# EAGLE design main (EAGLE 6.4)
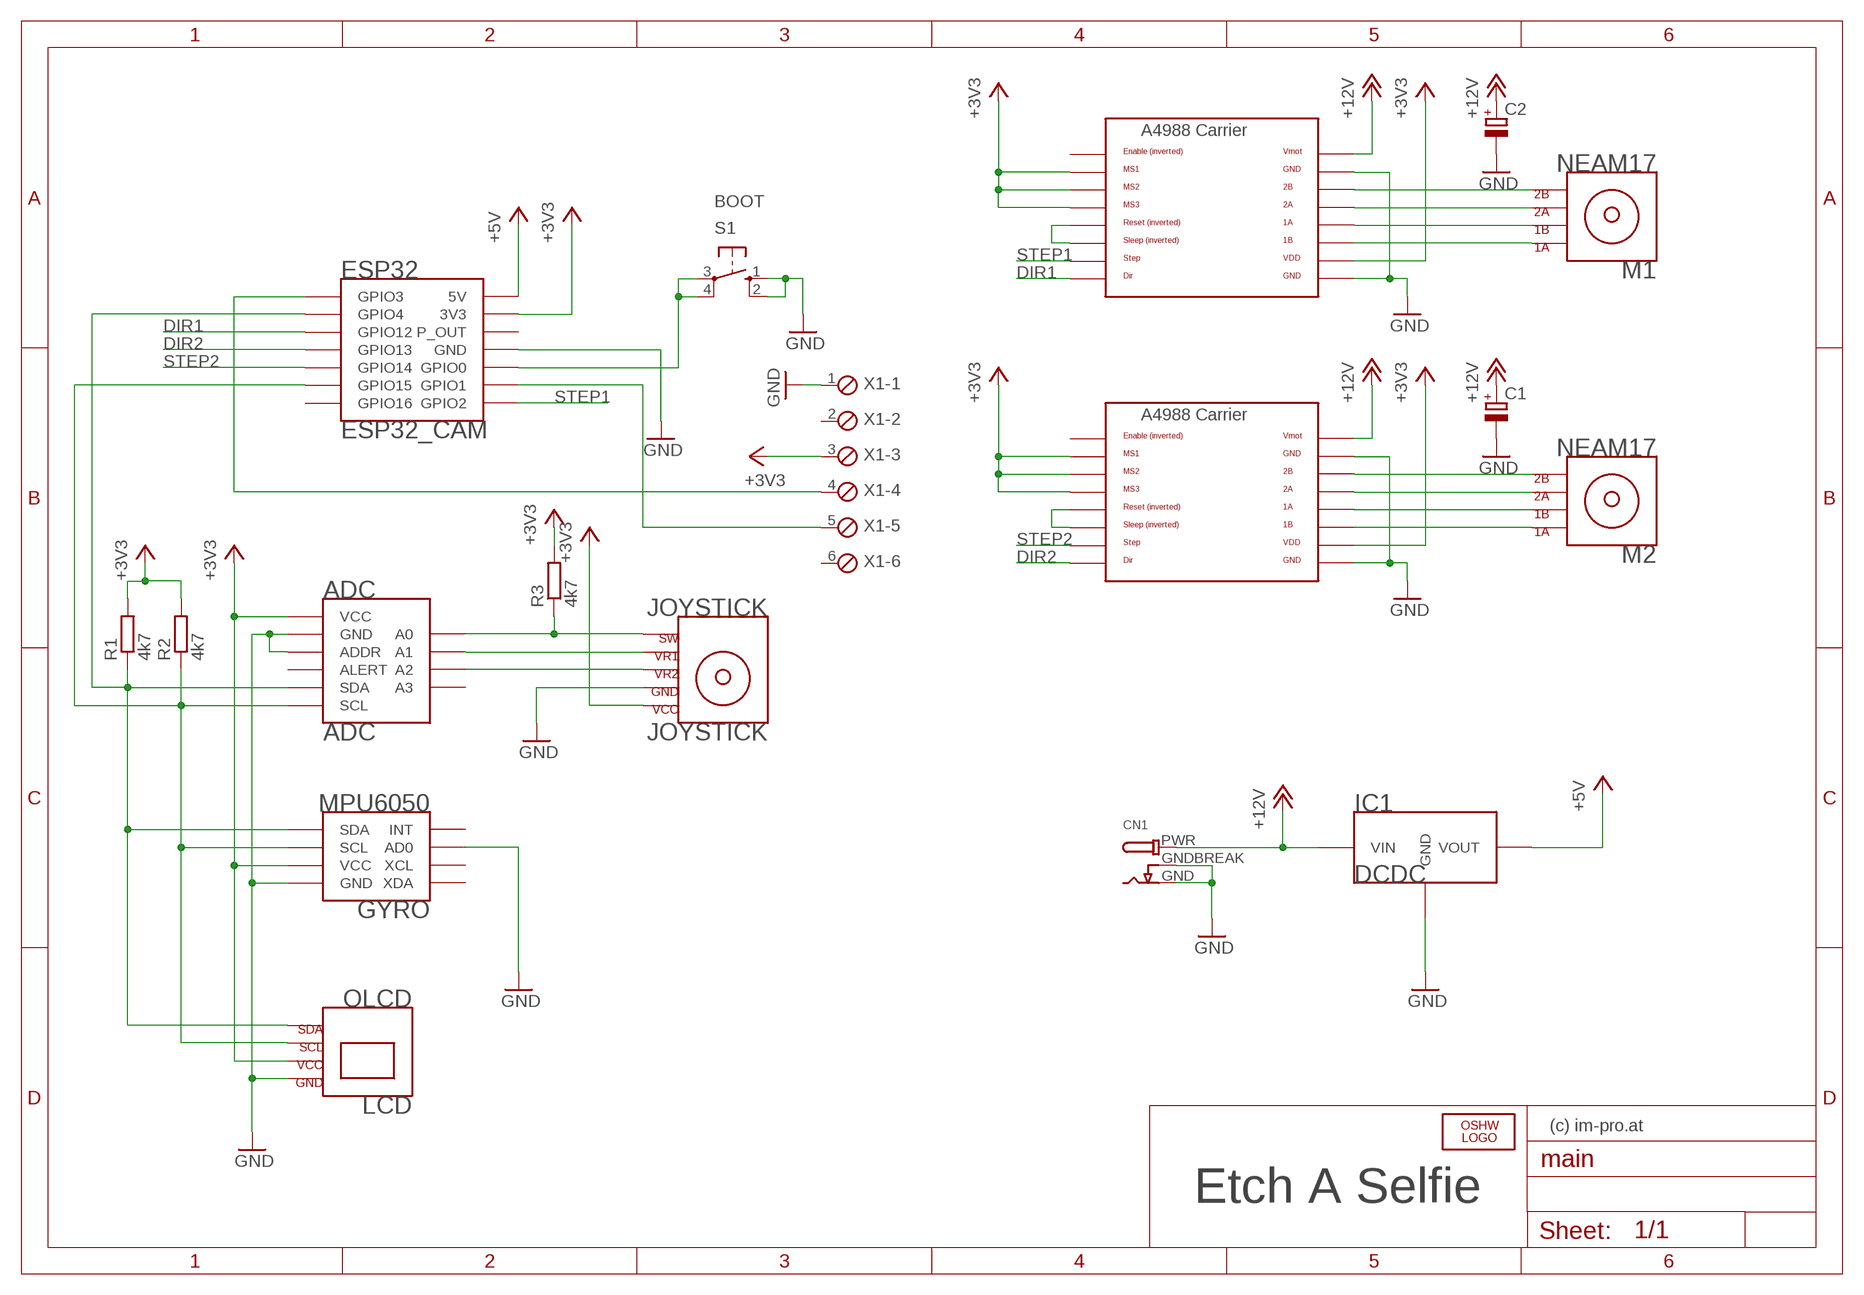
[diagram p0: schematic, sheet 1]

## Parts
ADC  ADC  [ADC]
C1  CPOL-EUE2.5-6  [E2,5-6]
C2  CPOL-EUE2.5-6  [E2,5-6]
CN1  DCBARRELPTH  [DCJACK_2MM_PTH]
ESP32  ESP32_CAM  [ESP32_CAM]
GYRO  MPU6050  [MPU6050]
IC1  DCDC  [DCDC]
IC2  A4988BREAKOUT  [A4988BREAKOUT]
IC3  A4988BREAKOUT  [A4988BREAKOUT]
JOYSTICK  JOYSTICK  [JOYSTICK]
LCD  OLCD  [OLCD]
LOGO1  OHW-LOGO_OSHW_LOGO_FILLX0350-NT  [OHW-LOGO_OSHW_FILLX350_NOTEXT]
M1  NEAM17  [NEMA17]
M2  NEAM17  [NEMA17]
R1  4k7  R-EU_0207/10  [0207/10]
R2  4k7  R-EU_0207/10  [0207/10]
R3  4k7  R-EU_0207/10  [0207/10]
S1  10-XX  [B3F-10XX]
X1  MPT6  [6POL254]

## Nets
+3V3: ADC.VCC ESP32.3V3 GYRO.VCC IC2.MS1 IC2.MS2 IC2.MS3 IC2.VDD IC3.MS1 IC3.MS2 IC3.MS3 IC3.VDD JOYSTICK.VCC LCD.VCC R1.2 R2.2 R3.2 X1.3
+5V: ESP32.5V IC1.VOUT
+12V: C1.+ C2.+ CN1.PWR IC1.VIN IC2.VMOT IC3.VMOT
DIR1: ESP32.GPIO12 IC2.DIR
DIR2: ESP32.GPIO13 IC3.DIR
GND: ADC.ADDR ADC.GND C1.- C2.- CN1.GND CN1.GNDBREAK ESP32.GND1(GND) ESP32.GND2(GND) ESP32.GND3(GND) GYRO.AD0 GYRO.GND IC1.GND1(GND) IC1.GND2(GND) IC2.GND IC2.GND@0(GND) IC3.GND IC3.GND@0(GND) JOYSTICK.GND LCD.GND S1.1(S) S1.2(S1) X1.1
N$1: IC2.1B M1.1A
N$2: IC2.RST IC2.SLP(SLEEP)
N$3: IC2.2B M1.2B
N$4: IC2.2A M1.2A
N$5: IC2.1A M1.1B
N$6: IC3.RST IC3.SLP(SLEEP)
N$7: IC3.2B M2.2B
N$8: IC3.2A M2.2A
N$9: IC3.1A M2.1B
N$10: IC3.1B M2.1A
N$11: ESP32.GPIO1 X1.5
N$12: ESP32.GPIO3 X1.4
N$13: ESP32.GPIO0 S1.3(P) S1.4(P1)
N$14: ADC.A0 JOYSTICK.SW R3.1
N$15: ADC.A1 JOYSTICK.VR1
N$16: ADC.A2 JOYSTICK.VR2
N$18: ADC.SCL ESP32.GPIO15 GYRO.SCL LCD.SCL R2.1
N$19: ADC.SDA ESP32.GPIO4 GYRO.SDA LCD.SDA R1.1
STEP1: ESP32.GPIO2 IC2.STEP
STEP2: ESP32.GPIO14 IC3.STEP
Unconnected: ADC.A3 ADC.ALERT ESP32.GPIO16 ESP32.P_OUT GYRO.INT GYRO.XCL GYRO.XDA IC2.EN IC3.EN X1.2 X1.6

## Notes on the sheet
- BOOT
- (c) im-pro.at
- Etch A Selfie

## Library data of the parts
ADC = main:ADC
C1 C2 = rcl:CPOL-EU: POLARIZED CAPACITOR, European symbol
CN1 = microbuilder:DCBARREL: DC Barrel Jack DCJACK_1.3MM_PTH - Through Hole 1.3mm Jack (4UConnector: 05536) DCJACK_2MM_PTH - Through Hole 2.0/2.1 Jack (4UConnector: 05537) DCJACK_2MM_SMT - SMT 2.0/2.1mm Jack(4UConnector: 03267)
ESP32 = main:ESP32_CAM
GYRO = main:MPU6050
IC1 = main:DCDC
IC2 IC3 = stepperdriver:A4988BREAKOUT
JOYSTICK = main:JOYSTICK
LCD = main:OLCD
LOGO1 = BBLeo_v2:OHW-LOGO_OSHW_LOGO_FILL
M1 M2 = main:NEAM17
R1-R3 = rcl:R-EU_: RESISTOR, European symbol
S1 = switch-omron:10-XX: OMRON SWITCH; MPN: B3F-1000; OC_FARNELL: 176432; OC_NEWARK: 36M3542
X1 = con-phoenix-254:MPT6: PHOENIX CONNECTOR; OC_FARNELL: unknown; OC_NEWARK: unknown

## Board
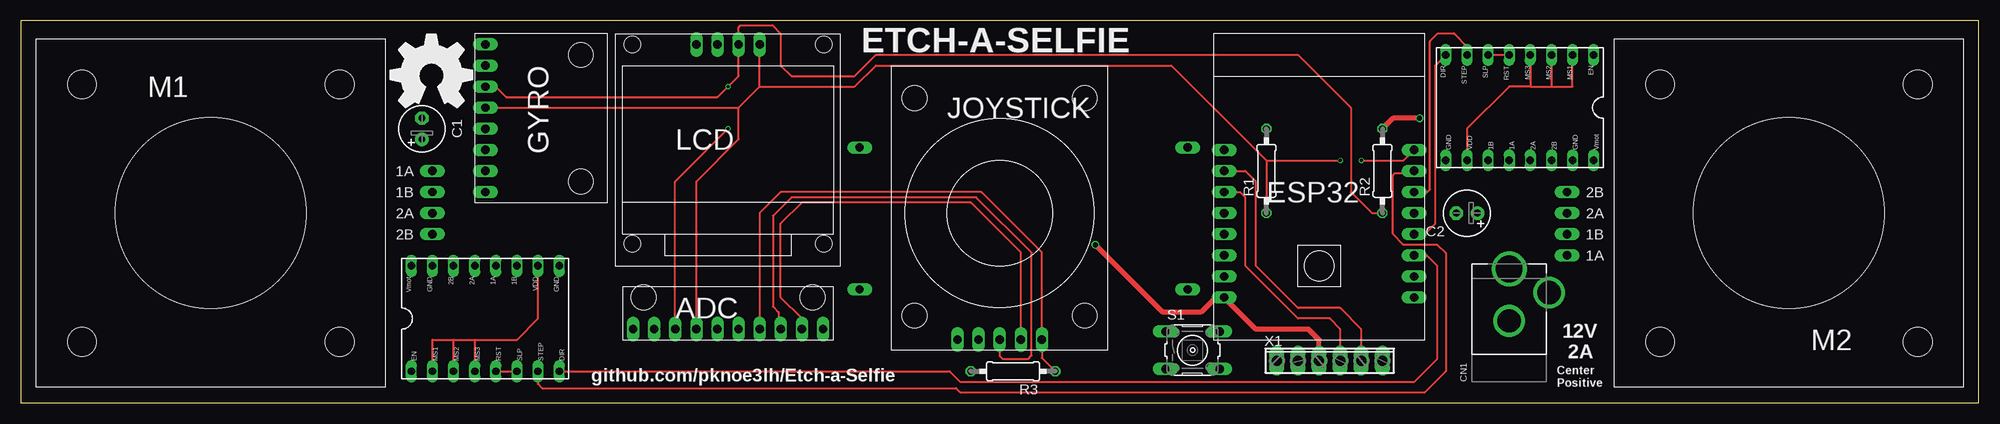
[diagram p1: board, top side]
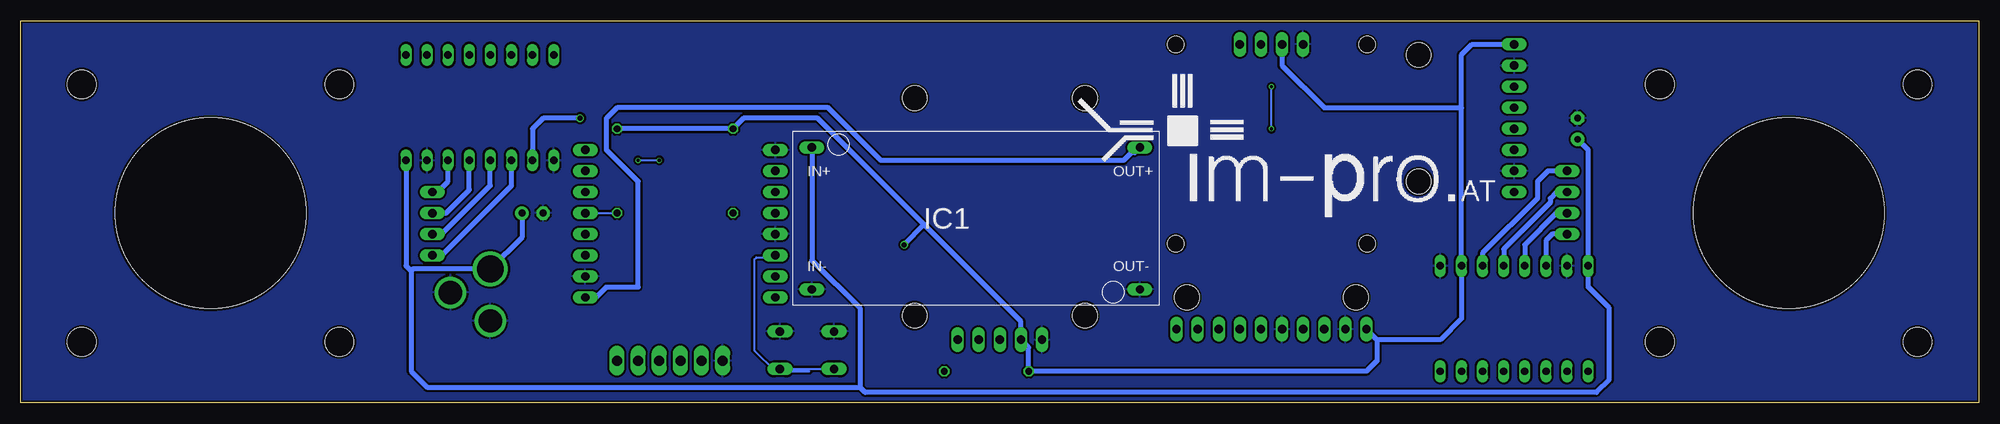
[diagram p2: board, bottom side, seen from below]

Size 235.56 x 46.03 mm. Coordinates in mm from the lower left corner, seen from the top.
Outline: 0,0 235.56,0 235.56,46.03 0,46.03 0,0
Copper layers (1*16): Top 0.035559375mm / dielectric 1.6mm / Bottom 0.035559375mm
Design rules "jlcpcb2layer": minimum track width 5mil, minimum drill 12mil, track to track 5mil, track to pad 5mil, pad to pad 5mil, via to via 5mil, smd to smd 5mil, copper to edge 8mil, drill to drill 6mil, minimum pad ring 5mil, minimum via ring 3mil, stop-mask expansion 2.5mil, vias tented up to drill 0mil, thermal gap 10mil

### Footprints (pad centres in the part's own frame; a part is rotated, then mirrored left to right if it is on the bottom)
ADC = drill 1 long: A0 3.81,0; A1 6.35,0; A2 8.89,0; A3 11.43,0; ADDR -1.27,0; ALERT 1.27,0; GND -8.89,0; SCL -6.35,0; SDA -3.81,0; VCC -11.43,0 | hole 3: -10.16,3.81; 10.16,3.81
E2,5-6 = drill 0.813 pad 1.6: + -1.27,0 | drill 0.813 pad 1.6 octagon: - 1.27,0
DCJACK_2MM_PTH = drill 2.8: GND 0,7.35; GNDBREAK 4.8,10.75 | drill 3.2: PWR 0,13.6
ESP32_CAM = drill 1 long: 3V3 -11.43,-12.7; 5V 11.43,-12.7; GND1 -11.43,5.08; GND2 -11.43,-5.08; GND3 11.43,-10.16; GPIO0 -11.43,-7.62; GPIO1 -11.43,2.54; GPIO2 11.43,2.54; GPIO3 -11.43,0; GPIO4 11.43,5.08; GPIO12 11.43,-7.62; GPIO13 11.43,-5.08; GPIO14 11.43,0; GPIO15 11.43,-2.54; GPIO16 -11.43,-10.16; P_OUT -11.43,-2.54
MPU6050 = drill 1 long: AD0 6.35,0; GND -6.35,0; INT 8.89,0; SCL -3.81,0; SDA -1.27,0; VCC -8.89,0; XCL 3.81,0; XDA 1.27,0 | hole 3: -7.62,11.5; 7.62,11.5
DCDC = drill 1 long: GND1 -19.73,-8.55; GND2 19.73,-8.55; VIN -19.73,8.55; VOUT 19.73,8.55
A4988BREAKOUT = drill 0.9 long: 1A 8.89,1.27; 1B 11.43,1.27; 2A 6.35,1.27; 2B 3.81,1.27; DIR 16.51,-11.43; EN -1.27,-11.43; GND 16.51,1.27; GND@0 1.27,1.27; MS1 1.27,-11.43; MS2 3.81,-11.43; MS3 6.35,-11.43; RST 8.89,-11.43; SLP 11.43,-11.43; STEP 13.97,-11.43; VDD 13.97,1.27; VMOT -1.27,1.27
JOYSTICK = drill 1 long: GND -5.08,0; SW 5.08,0; VCC -2.54,0; VR1 0,0; VR2 2.54,0 | hole 3: -10.25,2.9; 10.25,2.9; -10.25,29.1; 10.25,29.1
OLCD = drill 1 long: GND -3.81,0; SCL 1.27,0; SDA 3.81,0; VCC -1.27,0 | hole 2: -11.5,0; 11.5,0; -11.5,-24; 11.5,-24
NEMA17 = drill 1 long: 1A 26.67,5.08; 1B 26.67,2.54; 2A 26.67,0; 2B 26.67,-2.54 | hole 3.5: -15.5,-15.5; -15.5,15.5; 15.5,15.5; 15.5,-15.5 | hole 23: 0,0
0207/10 = drill 0.813 octagon: 1 -5.08,0; 2 5.08,0
B3F-10XX = drill 1.016 long: 1 -3.251,2.261; 2 3.251,2.261; 3 -3.251,-2.261; 4 3.251,-2.261
6POL254 = drill 1.2 pad 1.778 long: 1 -6.35,0; 2 -3.81,0; 3 -1.27,0; 4 1.27,0; 5 3.81,0; 6 6.35,0

### Placement (x,y rotation side)
ADC  85.09,8.89 0 top
C1  48.26,33.02 90 top
C2  173.99,22.86 180 top
CN1  179.07,2.54 0 top
ESP32  156.21,25.4 0 top
GYRO  55.88,34.29 270 top
IC1  120.65,22.22 0 bottom
IC2  48.26,15.24 0 top
IC3  187.96,30.48 180 top
JOYSTICK  117.77,7.62 0 top
LCD  85.09,43.18 0 top
LOGO1  44.45,35.56 0 top
M1  22.86,22.86 0 top
M2  212.73,22.86 180 top
R1  149.86,27.94 90 top
R2  163.83,27.94 90 top
R3  119.38,3.81 180 top
S1  140.97,6.35 0 top
X1  157.48,5.08 0 top

### Tracks (layer width: path | path; a pad name or v marks a point on that pad's centre or on a via)
+3V3  (via drill 0.6)
  Top 0.254: IC3.MS3 181.61,38.1 | 181.61,38.1 184.15,38.1 | 184.15,38.1 186.69,38.1 IC3.MS1 | IC3.MS2 184.15,38.1 | 181.61,38.1 179.07,38.1 173.99,33.02 IC3.VDD | IC2.MS1 49.53,7.62 52.07,7.62 | 52.07,7.62 54.61,7.62 | 54.61,7.62 IC2.MS3 | IC2.MS2 52.07,7.62 | 54.61,7.62 59.69,7.62 62.23,10.16 IC2.VDD
  Top 0.61: X1.3 156.21,7.62 154.94,8.89 148.59,8.89 ESP32.3V3 143.76,12.7 141.99,10.92 137.41,10.92 v129.29,19.05 | v168.28,34.29 165.1,34.29 R2.2
  Bottom 0.61: 173.99,30.48 IC3.VDD 173.99,33.02 172.72,34.29 v168.28,34.29 | 62.23,35.56 IC2.VDD 62.23,10.16 64.77,7.62 72.39,7.62 | 62.23,35.56 62.23,41.91 60.96,43.18 GYRO.VCC | 62.23,35.56 78.74,35.56 83.82,40.64 LCD.VCC | ADC.VCC 72.39,7.62 | 72.39,7.62 72.39,5.08 73.66,3.81 R3.2 114.3,6.69 JOYSTICK.VCC 115.23,9.82 126.87,21.46 | 126.87,21.46 139.7,34.29 148.59,34.29 R1.2 R2.2 | v129.29,19.05 126.87,21.46
+5V
  Bottom 0.61: ESP32.5V 166.37,12.7 165.1,13.97 161.29,13.97 161.29,26.67 165.1,30.48 165.1,34.29 163.83,35.56 138.43,35.56 132.08,29.21 102.87,29.21 101.94,30.14 101.55,30.14 IC1.VOUT
+12V
  Bottom 0.61: IC3.VMOT 189.23,16.51 188.59,15.88 | 188.59,15.88 188.59,3.81 186.69,1.91 134.62,1.91 | IC1.VIN 140.38,17.19 134.62,11.43 134.62,1.91 | C2.+ 175.26,19.95 CN1.PWR 188.33,16.14 188.59,15.88 | C1.+ 46.99,30.48 IC2.VMOT 46.99,13.97 44.45,11.43 44.45,2.79 45.97,1.27 133.99,1.27 134.62,1.91
DIR1
  Top 0.254: IC2.DIR 111.76,3.81 113.03,2.54 167.64,2.54 170.43,5.33 170.43,16.51 169.16,17.78 ESP32.GPIO12
DIR2
  Top 0.254: ESP32.GPIO13 168.91,20.32 170.18,21.59 170.18,40.64 IC3.DIR
GND
  pour Bottom (isolate 0.254): 0,0 235.59,0 235.59,45.72 0,45.72
N$1
  Bottom 0.61: M1.1A 51.82,27.94 53.09,26.67 53.09,24.64 59.69,18.03 IC2.1B
N$2
  Top 0.254: IC2.RST IC2.SLP
N$3
  Bottom 0.61: M1.2B 51.31,20.32 52.07,19.56 IC2.2B
N$4
  Bottom 0.61: M1.2A 50.8,22.86 54.61,19.05 IC2.2A
N$5
  Bottom 0.61: M1.1B 50.8,25.4 51.56,24.64 51.56,24.13 57.15,18.54 IC2.1A
N$6
  Top 0.254: IC3.SLP IC3.RST
N$7
  Bottom 0.61: M2.2B 185.42,25.4 184.15,26.67 IC3.2B
N$8
  Bottom 0.61: M2.2A 184.4,22.86 181.61,25.65 IC3.2A
N$9
  Bottom 0.61: M2.1B 184.91,20.32 179.07,26.16 IC3.1A
N$10
  Bottom 0.61: M2.1A 184.91,17.78 176.53,26.16 IC3.1B
N$11
  Top 0.254: X1.5 161.29,8.89 158.75,11.43 153.67,11.43 148.59,16.51 148.59,26.67 147.32,27.94 ESP32.GPIO1
N$12
  Top 0.254: X1.4 158.75,8.89 157.48,10.16 153.67,10.16 147.32,16.51 147.32,24.77 146.69,25.4 ESP32.GPIO3
N$13
  Bottom 0.254: S1.3 S1.4 140.69,3.81 144.78,3.81 147.32,6.35 147.32,17.27 147.07,17.53 145.03,17.53 ESP32.GPIO0
N$14
  Top 0.254: R3.1 122.85,5.42 JOYSTICK.SW 122.85,18.12 115.57,25.4 91.44,25.4 88.9,22.86 ADC.A0
N$15
  Top 0.254: ADC.A1 91.19,9.14 91.19,10.92 90.49,11.62 90.49,22.54 92.71,24.77 114.94,24.77 121.6,18.1 121.6,5.71 121.22,5.33 118.11,5.33 117.77,5.67 JOYSTICK.VR1
N$16
  Top 0.254: JOYSTICK.VR2 120.31,18.12 114.3,24.13 93.98,24.13 91.44,21.59 91.44,12.7 93.98,10.16 ADC.A2
N$18  (via drill 0.4)
  Top 0.254: ADC.SCL 78.74,26.67 v85.09,33.02 | R2.1 162.56,22.86 160.02,25.4 160.02,35.56 153.67,41.91 102.87,41.91 100.33,39.37 92.71,39.37 91.44,40.64 91.44,44.45 90.42,45.47 86.61,45.47 86.36,45.21 LCD.SCL 86.36,39.37 v85.09,38.1 83.82,36.83 58.42,36.83 57.15,38.1 GYRO.SCL
  Bottom 0.254: v85.09,33.02 v85.09,38.1 | ESP32.GPIO15 R2.1
N$19  (via drill 0.4)
  Top 0.254: GYRO.SDA 86.36,35.56 | 86.36,35.56 88.9,38.1 | 88.9,38.1 LCD.SDA | ADC.SDA 81.28,26.67 86.36,31.75 86.36,35.56 | 88.9,38.1 100.33,38.1 102.87,40.64 138.43,40.64 149.86,29.21 | 149.86,29.21 R1.1 | 149.86,29.21 v158.75,29.21 | v161.29,29.21 166.37,29.21 ESP32.GPIO4
  Bottom 0.254: v158.75,29.21 v161.29,29.21
STEP1
  Top 0.254: ESP32.GPIO2 167.39,27.69 165.35,27.69 165.1,27.43 165.1,20.32 166.37,19.05 170.43,19.05 171.45,18.03 171.45,3.81 168.91,1.27 113.03,1.27 112.52,1.78 62.74,1.78 62.23,2.29 IC2.STEP
STEP2
  Top 0.254: ESP32.GPIO14 169.23,25.4 169.55,25.72 169.55,43.56 170.43,44.45 172.47,44.45 173.99,42.93 IC3.STEP

### Text on the board
tPlace: ETCH-A-SELFIE | 12V | 2A | github.com/pknoe3lh/Etch-a-Selfie | Center / Positive